# EAGLE design Grip-Mother (EAGLE 9.6.2)
COMPANY: ADAFRUIT INDUSTRIES; DRAWN: KTOWN; REV: B
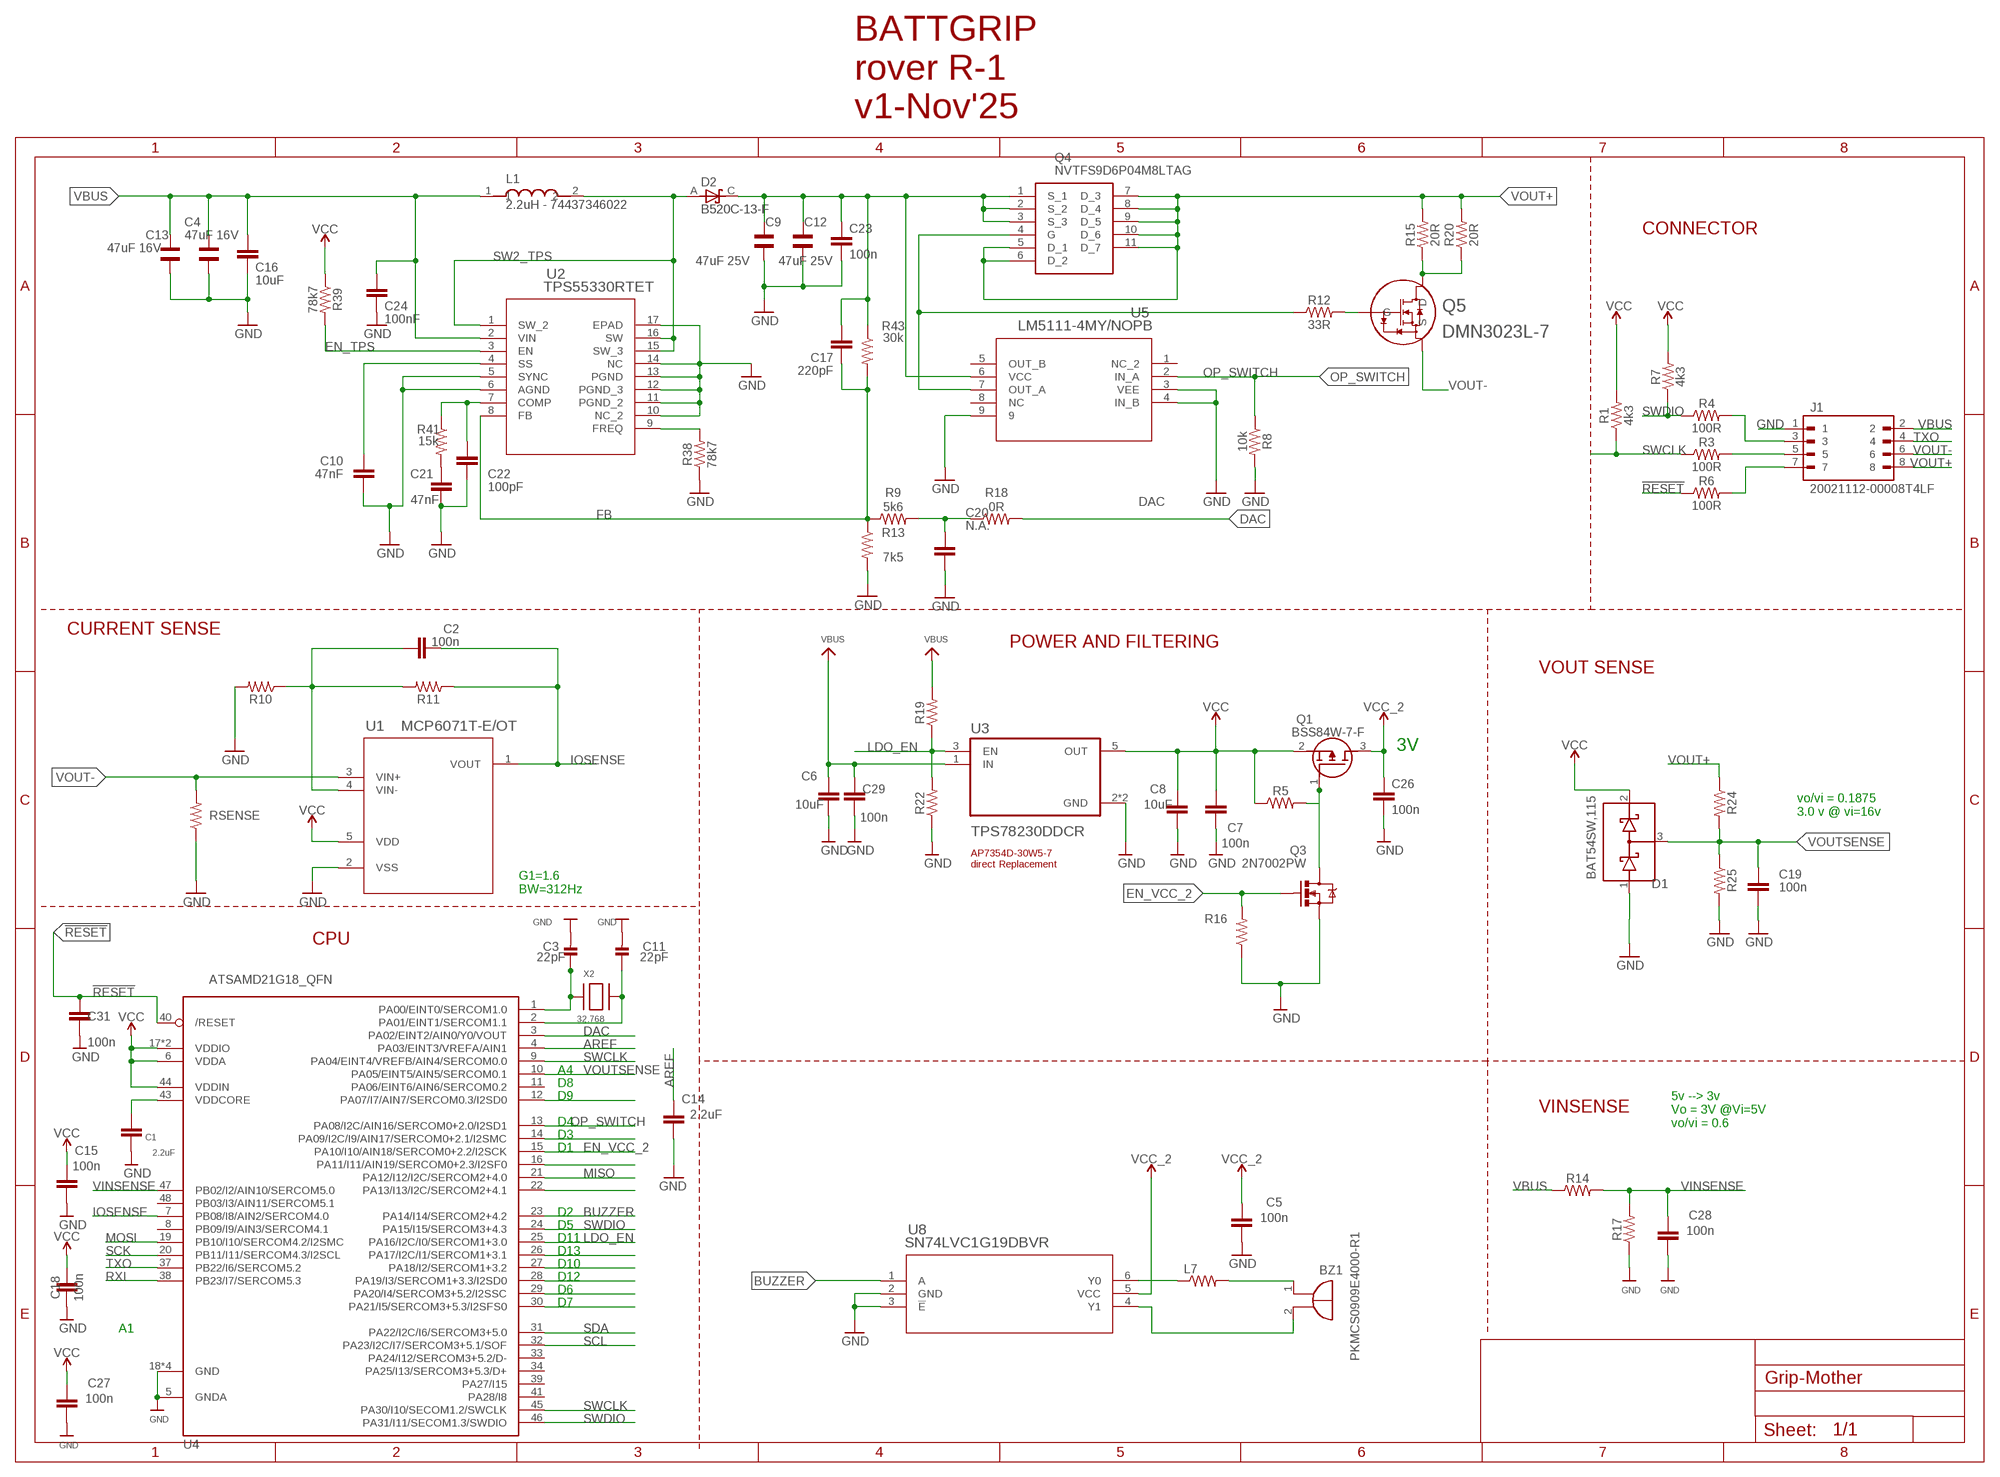
[diagram p0: schematic, sheet 1]

## Parts
BZ1  PKMCS0909E4000-R1  [PKMCS0909]
C1  2.2uF  2.2UF-0603-10V-20%  [0603]
C2  100n  0.1UF-0603-25V-(+80/-20%)  [0603]
C3  22pF  CAP_CERAMIC0603_NO  [0603-NO]
C4  47uF 16V  WCAP-CSGP_1210_885012109003  [WCAP-CSGP_1210]
C5  100n  0.1UF-0402-16V-10%  [0402]
C6  10uF  2.2UF-0603-10V-20%  [0603]
C7  100n  0.1UF-0402-16V-10%  [0402]
C8  10uF  2.2UF-0603-10V-20%  [0603]
C9  47uF 25V  WCAP-CSGP_1210_885012109003  [WCAP-CSGP_1210]
C10  47nF  47NF-0603-25V-5%  [0603]
C11  22pF  CAP_CERAMIC0603_NO  [0603-NO]
C12  47uF 25V  WCAP-CSGP_1210_885012109003  [WCAP-CSGP_1210]
C13  47uF 16V  WCAP-CSGP_1210_885012109003  [WCAP-CSGP_1210]
C14  2.2uF  2.2UF-0603-10V-20%  [0603]
C15  100n  0.1UF-0402-16V-10%  [0402]
C16  10uF  10UF-0805-10V-10%  [0805]
C17  220pF  270PF-0603-50V-5%  [0603]
C18  100n  0.1UF-0402-16V-10%  [0402]
C19  100n  0.1UF-0603-25V-(+80/-20%)  [0603]
C20  N.A.  0.1UF-0603-25V-(+80/-20%)  [0603]
C21  47nF  2.2NF/2200PF-0603-50V-10%  [0603]
C22  100pF  270PF-0603-50V-5%  [0603]
C23  100n  0.1UF-0603-25V-(+80/-20%)  [0603]
C24  100nF  0.1UF-0603-25V-(+80/-20%)  [0603]
C26  100n  0.1UF-0402-16V-10%  [0402]
C27  100n  0.1UF-0402-16V-10%  [0402]
C28  100n  0.1UF-0402-16V-10%  [0402]
C29  100n  0.1UF-0402-16V-10%  [0402]
C31  100n  0.1UF-0402-16V-10%  [0402]
D1  BAT54SW,115  [SOT65P210X110-3N]
D2  B520C-13-F  [DIOM7959X250N]
J1  20021112-00008T4LF  [AMPHENOL_20021112-00008T4LF]
L1  2.2uH - 74437346022  74437349100  [INDM7366X500]
L7  MMZ2012Y202BT000  RESISTOR0805-RES  [0805]
Q1  BSS84W-7-F  [SOT65P222X110-3N]
Q3  2N7002PW  MOSFET-NCHANNEL2N7002PW  [SOT323]
Q4  NVTFS9D6P04M8LTAG  [NVTFS5124PLTWG]
Q5  DMN3023L-7  PMV20XNERSOT23-TO-236AB_NEX-L  [SOT23-TO-236AB_NEX-L]
R1  4k3  RESISTOR0402  [0402]
R3  100R  RESISTOR0402  [0402]
R4  100R  RESISTOR0402  [0402]
R5  RESISTOR0402  [0402]
R6  100R  RESISTOR0402  [0402]
R7  4k3  RESISTOR0402  [0402]
R8  10k  RESISTOR0402  [0402]
R9  5k6  RESISTOR0402  [0402]
R10  RESISTOR0402  [0402]
R11  RESISTOR0402  [0402]
R12  33R  RESISTOR0402  [0402]
R13  7k5  RESISTOR0402  [0402]
R14  RESISTOR0402  [0402]
R15  20R  RESISTOR1206  [1206]
R16  RESISTOR0402  [0402]
R17  RESISTOR0402  [0402]
R18  0R  RESISTOR0402  [0402]
R19  RESISTOR0402  [0402]
R20  20R  RESISTOR1206  [1206]
R22  RESISTOR0402  [0402]
R24  RESISTOR0402  [0402]
R25  RESISTOR0402  [0402]
R38  78k7  RESISTOR0402  [0402]
R39  78k7  RESISTOR0402  [0402]
R41  15k  RESISTOR0402  [0402]
R43  30k  RESISTOR0402  [0402]
RSENSE  RESISTOR1206  [1206]
U1  MCP6071T-E/OT  [SOT-23-5_MC_MCH]
U2  TPS55330RTET  [RTE16_1P66X1P66_TEX]
U3  TPS78230DDCR  [SOT95P280X110-5N]
U4  ATSAMD21G18_QFN  ATSAMD21J_QFN  [TQFN48_7MM]
U5  LM5111-4MY/NOPB  [MUY08A]
U8  SN74LVC1G19DBVR  [DBV6]
X2  32.768  XTAL-3.2X1.5  [XTAL3215]

## Nets
!RESET: C31.1 R6.1 U4.40(/RESET)
AREF: C14.1 U4.4(PA03/EINT3/VREFA/AIN1)
BUZZER: U4.23(PA14/I14/SERCOM2+4.2) U8.1(A)
COMP_TPS: C22.2 R41.1 U2.7(COMP)
DAC: R18.2 U4.3(PA02/EINT2/AIN0/Y0/VOUT)
EN_TPS: R39.2 U2.3(EN)
EN_VCC_2: Q3.1(G) R16.2 U4.15(PA10/I10/AIN18/SERCOM0+2.2/I2SCK)
FB: C17.1 R9.1 R13.1 R43.2 U2.8(FB)
FREQ_TPS: R38.2 U2.9(FREQ)
GND: C1.2 C3.2 C4.1 C5.2 C6.2 C7.2 C8.2 C9.1 C10.2 C11.2 C12.1 C13.1 C14.2 C15.2 C16.1 C18.2 C19.2 C20.2 C21.1 C22.1 C23.2 C24.1 C26.2 C27.2 C28.2 C29.2 C31.2 D1.1(A) J1.1 Q3.2(S) R8.2 R10.2 R13.2 R16.1 R17.1 R22.1 R25.2 R38.1 RSENSE.1 U1.2(VSS) U2.5(SYNC) U2.6(AGND) U2.10(NC_2) U2.11(PGND_2) U2.12(PGND_3) U2.13(PGND) U2.14(NC) U2.17(EPAD) U3.2(GND) U3.4(GND) U4.5(GNDA) U4.18(GND) U4.35(GND) U4.42(GND) U4.THERMAL(GND) U5.3(VEE) U5.4(IN_B) U5.9 U8.2(GND) U8.3(!E)
IOSENSE: C2.1 R11.1 U1.1(VOUT) U4.7(PB08/I8/AIN2/SERCOM4.0)
LDO_EN: R19.1 R22.2 U3.3(EN) U4.25(PA16/I2C/I0/SERCOM1+3.0)
MISO: U4.21(PA12/I12/I2C/SERCOM2+4.0)
MOSI: U4.19(PB10/I10/SERCOM4.2/I2SMC)
N$1: Q4.4(G) R12.1 U5.7(OUT_A)
N$2: J1.7 R6.2
N$3: J1.5 R3.2
N$5: C2.2 R10.1 R11.2 U1.4(VIN-)
N$6: Q1.1(G) Q3.3(D) R5.2
N$7: U4.14(PA09/I2C/I9/AIN17/SERCOM0+2.1/I2SMC)
N$8: Q5.3(D) R15.1 R20.1
N$9: C3.1 U4.1(PA00/EINT0/SERCOM1.0) X2.P$1
N$10: C11.1 U4.2(PA01/EINT1/SERCOM1.1) X2.P$2
N$11: J1.3 R4.2
N$12: C20.1 R9.2 R18.1
N$13: Q5.1(G) R12.2
N$14: U4.16(PA11/I11/AIN19/SERCOM0+2.3/I2SF0)
N$15: U4.22(PA13/I13/I2C/SERCOM2+4.1)
N$17: L7.1 U8.6(Y0)
N$18: U4.26(PA17/I2C/I1/SERCOM1+3.1)
N$19: BZ1.1(+) L7.2
N$20: U4.27(PA18/I2/SERCOM1+3.2)
N$21: U4.28(PA19/I3/SERCOM1+3.3/I2SD0)
N$22: BZ1.2(-) U8.4(Y1)
N$23: U4.29(PA20/I4/SERCOM3+5.2/I2SSC)
N$24: U4.30(PA21/I5/SERCOM3+5.3/I2SFS0)
N$25: U4.12(PA07/I7/AIN7/SERCOM0.3/I2SD0)
N$35: C10.1 U2.4(SS)
N$43: C21.2 R41.2
OP_SWITCH: R8.1 U4.13(PA08/I2C/AIN16/SERCOM0+2.0/I2SD1) U5.2(IN_A)
RXI: U4.38(PB23/I7/SERCOM5.3)
SCK: U4.20(PB11/I11/SERCOM4.3/I2SCL)
SCL: U4.32(PA23/I2C/I7/SERCOM3+5.1/SOF)
SDA: U4.31(PA22/I2C/I6/SERCOM3+5.0)
SW2_TPS: D2.A L1.2 U2.1(SW_2) U2.15(SW_3) U2.16(SW)
SWCLK: R1.1 R3.1 U4.9(PA04/EINT4/VREFB/AIN4/SERCOM0.0) U4.45(PA30/I10/SECOM1.2/SWCLK)
SWDIO: R4.1 R7.1 U4.24(PA15/I15/SERCOM3+4.3) U4.46(PA31/I11/SECOM1.3/SWDIO)
TXO: J1.4 U4.37(PB22/I6/SERCOM5.2)
VBUS: C4.2 C6.1 C13.2 C16.2 C24.2 C29.1 J1.2 L1.1 R14.1 R19.2 U2.2(VIN) U3.1(IN)
VCC: C7.1 C8.1 C15.1 C18.1 C27.1 D1.2(C) Q1.2(S) R1.2 R5.1 R7.2 R39.1 U1.5(VDD) U3.5(OUT) U4.6(VDDA) U4.17(VDDIO) U4.36(VDDIO) U4.44(VDDIN)
VCC_2: C5.1 C26.1 Q1.3(D) U8.5(VCC)
VDDCORE1: C1.1 U4.43(VDDCORE)
VINSENSE: C28.1 R14.2 R17.2 U4.47(PB02/I2/AIN10/SERCOM5.0)
VOUT+: J1.8 Q4.5(D_1) Q4.6(D_2) Q4.7(D_3) Q4.8(D_4) Q4.9(D_5) Q4.10(D_6) Q4.11(D_7) R15.2 R20.2 R24.1
VOUT-: J1.6 Q5.2(S) RSENSE.2 U1.3(VIN+)
VOUTSENSE: C19.1 D1.3(A-C) R24.2 R25.1 U4.10(PA05/EINT5/AIN5/SERCOM0.1)
VSOURCE: C9.2 C12.2 C17.2 C23.1 D2.C Q4.1(S_1) Q4.2(S_2) Q4.3(S_3) R43.1 U5.6(VCC)
Unconnected: U4.8(PB09/I9/AIN3/SERCOM4.1) U4.11(PA06/EINT6/AIN6/SERCOM0.2) U4.33(PA24/I12/SERCOM3+5.2/D-) U4.34(PA25/I13/SERCOM3+5.3/D+) U4.39(PA27/I15) U4.41(PA28/I8) U4.48(PB03/I3/AIN11/SERCOM5.1) U5.1(NC_2) U5.5(OUT_B) U5.8(NC)

## Notes on the sheet
- BATTGRIP
  rover R-1
  v1-Nov'25
- CONNECTOR
- CURRENT SENSE
- POWER AND FILTERING
- VOUT SENSE
- 3V
- vo/vi = 0.1875
  3.0 v @ vi=16v
- AP7354D-30W5-7 
  direct Replacement
- G1=1.6
  BW=312Hz
- CPU
- A4
- D8
- D9
- VINSENSE
- D4
- D3
- D1
- 5v --> 3v
  Vo = 3V @Vi=5V
  vo/vi = 0.6
- D2
- D5
- D11
- D13
- D10
- D12
- D6
- D7
- A1

## Library data of the parts
BZ1 = buzzer:PKMCS0909E4000-R1: PKMCS0909E4000-R1 Source : http://www.murata.com/~/media/webrenewal/products/sound/sounder/vppt-buzj083-d.ashx
C1 C14 = SparkFun-Capacitors:2.2UF: 2.2µF ceramic capacitors A capacitor is a passive two-terminal electrical component used to store electrical energy temporarily in an electric field.; PROD_ID: CAP-07888
C2 C19 C20 C23 C24 = SparkFun-Capacitors:0.1UF: 0.1µF ceramic capacitors A capacitor is a passive two-terminal electrical component used to store electrical energy temporarily in an electric field.; PROD_ID: CAP-00810; VALUE: 0.1uF
C3 C11 = microbuilder:CAP_CERAMIC: Ceramic Capacitors For new designs, use the packages preceded by an '_' character since they are more reliable: The following footprints should be used on most boards: _0402 - Standard footprint for regular board layouts _0603 - Standard footprint for regular board layouts _0805 - Standard footprint for regular board layouts _1206 - Standard footprint for regular board layouts For extremely tight-pitch boards where space is at a premium, the following 'micro-pitch' footprints can be used (smaller pads, no silkscreen outline, etc.): _0402MP - Micro-pitch footprint for very dense/compact boards _0603MP - Micro-pitch footprint for very dense/compact boards _0805MP - Micro-pitch footprint for very dense/compact boards _1206MP - Micro-pitch footprint for very dense/compact boards
C4 C9 C12 C13 = Wurth_Elektronik_Passive_Capacitors_rev19a:WCAP-CSGP_1210: WCAP-CSGP Ceramic Capacitors Characteristics Multilayer Ceramic Chip Capacitor Recommended soldering:Reflow, for 0603 and 0805 wave soldering is also allowed Operating temperature:-55 °C to +125 °C; Ceramic characteristics: Class I - NPO ; Class II -X7R, X5R High performance ceramic High capacitance stability Minimal aging Termination:Cu/Ni/Sn <http://katalog.we-online.de/media/images/eisos/WCAP-CSGP_pf2.jpg> Details see: http://katalog.we-online.de/en/pbs/WCAP-CSGP-1210? Created: 2015-01-28 2015 (C) Wurth Elektronik; WE-NUMBER: 885012109003/47uF
C5 C7 C15 C18 C26-C29 C31 = SparkFun-Capacitors:0.1UF: 0.1µF ceramic capacitors A capacitor is a passive two-terminal electrical component used to store electrical energy temporarily in an electric field.; PROD_ID: CAP-12416; VALUE: 0.1uF
C6 C8 = SparkFun-Capacitors:2.2UF: 2.2µF ceramic capacitors A capacitor is a passive two-terminal electrical component used to store electrical energy temporarily in an electric field.; PROD_ID: CAP-07888; VALUE: 2.2uF
C10 = SparkFun-Capacitors:47NF: 47nF ceramic capacitors A capacitor is a passive two-terminal electrical component used to store electrical energy temporarily in an electric field.; PROD_ID: CAP-08605
C16 = SparkFun-Capacitors:10UF: 10.0µF ceramic capacitors A capacitor is a passive two-terminal electrical component used to store electrical energy temporarily in an electric field.; PROD_ID: CAP-11330
C17 C22 = SparkFun-Capacitors:270PF: 270pF/0.27nF ceramic capacitors A capacitor is a passive two-terminal electrical component used to store electrical energy temporarily in an electric field.; PROD_ID: CAP-13339; VALUE: 270PF
C21 = SparkFun-Capacitors:2.2NF/2200PF: 2.2nF/2,200pF ceramic capacitors A capacitor is a passive two-terminal electrical component used to store electrical energy temporarily in an electric field.; PROD_ID: CAP-07877; VALUE: 2.2nF
D1 = BAT54SW_115:BAT54SW,115: BAT54W Series 30 V 600 mA SMT Schottky Barrier Double Diode -SOT-323 Check availability <https://pricing.snapeda.com/parts/BAT54SW%2C115/Nexperia%20USA%20Inc./view-part?ref=eda>; AVAILABILITY: In Stock; DESCRIPTION: Diode Array 1 Pair Series Connection Schottky 30 V 200mA (DC) Surface Mount SC-70, SOT-323; MF: Nexperia USA Inc.; MP: BAT54SW,115; PACKAGE: SOT-323 Nexperia USA Inc.; PRICE: None; PURCHASE-URL: https://pricing.snapeda.com/search/part/BAT54SW,115/?ref=eda
D2 = B520C-13-F:B520C-13-F: 5.0A SURFACE MOUNT SCHOTTKY BARRIER RECTIFIER; AVAILABILITY: Unavailable; DESCRIPTION: Diode Schottky 20V 5A Surface Mount SMC; DIGIKEY-PURCHASE-URL: https://snapeda.com/shop?store=DigiKey&id=325969; MF: Diodes Inc.; MP: B520C-13-F; PACKAGE: DO-214 Diodes Inc.; PRICE: None
J1 = 20021112-00008T4LF:20021112-00008T4LF; CHECK_PRICES: https://www.snapeda.com/parts/20021112-00008T4LF/Amphenol/view-part/?ref=eda; DESCRIPTION: Minitek127, Board to Board connector, Unshrouded Right Angled Header, Through Hole, Double Row, 8 Positions, 1.27 mm (.050in) Pitch.; DIGIKEY_PART_NUMBER: 609-5925-ND; MF: AMPHENOL ICC / FCI; MP: 20021112-00008T4LF; PACKAGE: None; SNAPEDA_LINK: https://www.snapeda.com/parts/20021112-00008T4LF/Amphenol/view-part/?ref=snap
L1 = Inductance_2.2uH:74437349100: Inductor, SMD [Würth Elektronik] 74437349100 Inductor, SMD; DESCRIPTION: 10µH Shielded Molded Inductor 3.2A 69mOhm Max Nonstandard; DIGIKEY-PURCHASE-URL: https://snapeda.com/shop?store=DigiKey&id=586788; MF: Wurth Electronics; MP: 74437349100; PACKAGE: Nonstandard Wurth Electronics
L7 = SparkFun:RESISTOR: Resistor Basic schematic elements and footprints for 0603, 1206, and PTH resistors.
Q1 = BSS84W-7-F:BSS84W-7-F: Lattice Source: Datasheet <https://www.diodes.com/assets/Datasheets/BSS84W.pdf>; DESCRIPTION: Lattice; HEIGHT: 1.1mm; MANUFACTURER_NAME: Lattice Semiconductor; MANUFACTURER_PART_NUMBER: BSS84W-7-F; MOUSER_PART_NUMBER: N/A; MOUSER_PRICE-STOCK: https://www.mouser.com/Search/Refine.aspx?Keyword=N%2FA
Q3 = SparkFun-DiscreteSemi:MOSFET-NCHANNEL: Common NMOSFET Parts MFG P/N Store ID Prod ID FDD8780 TRANS-09984 SI7820DN TRANS-11055 FDS6630A IC-08089 2N7002PW TRANS-11151 FQP30N06L COM-10213 TRANS-10060 BSS123LT1G TRANS-08345 BSS138 TRANS-00830 BS170 2N7000; PROD_ID: TRANS-11151
Q4 = SamacSys_Parts:NVTFS9D6P04M8LTAG: MOSFET MV8 P INITIAL PROGRAM Source: Datasheet <https://www.onsemi.com/pub/Collateral/NVTFS9D6P04M8L-D.PDF>; DESCRIPTION: MOSFET MV8 P INITIAL PROGRAM; HEIGHT: 0.8mm; MANUFACTURER_NAME: ON Semiconductor; MANUFACTURER_PART_NUMBER: NVTFS9D6P04M8LTAG; MOUSER_PART_NUMBER: 863-NVTFS9D6P04M8LTG; MOUSER_PRICE-STOCK: https://www.mouser.co.uk/ProductDetail/ON-Semiconductor/NVTFS9D6P04M8LTAG/?qs=xZ%2FP%252Ba9zWqYALd8g5rll2Q%3D%3D
Q5 = PMV20XNER:PMV20XNER; COPYRIGHT: Copyright (C) 2023 Ultra Librarian. All rights reserved.; MANUFACTURER_PART_NUMBER: PMV20XNER; MFR_NAME: Nexperia
R1 R3-R20 R22 R24 R25 R38 R39 R41 R43 RSENSE = SparkFun-Resistors:RESISTOR: Generic Resistor Package
U1 = MCP6071:MCP6071T-E/OT; BUILT_BY: EMA_Jessica; COPYRIGHT: Copyright (C) 2018 Accelerated Designs. All rights reserved; MANUFACTURER_PART_NUMBER: MCP6071T-E/OT; SOURCELIBRARY: Microchip_2019-08-23_21; VENDOR: Microchip
U2 = TPS55330:TPS55330RTET; BUILT_BY: EMA_UL_Team; MANUFACTURER_PART_NUMBER: TPS55330RTET; SOURCELIBRARY: TI_2015-1-5; VENDOR: Texas Instruments
U3 = TPS78230DDCR:TPS78230DDCR: Check prices <https://pricing.snapeda.com/parts/TPS78230DDCR/Texas%20Instruments/view-part?ref=eda>; AVAILABILITY: Good; DESCRIPTION: 150-mA, nano-IQ, low-dropout voltage regulator with enable from -40C to +125C 5-SOT-23-THIN -40 to 125; MF: Texas Instruments; MP: TPS78230DDCR; PACKAGE: SOT-23-THN-5 Texas Instruments; PRICE: None; PURCHASE-URL: https://pricing.snapeda.com/search/part/TPS78230DDCR/?ref=eda
U4 = microbuilder:ATSAMD21J
U5 = LM5111-4MY:LM5111-4MY/NOPB; COPYRIGHT: Copyright (C) 2024 Ultra Librarian. All rights reserved.; MANUFACTURER_PART_NUMBER: LM5111-4MY/NOPB; MFR_NAME: Texas Instruments; TYPE: LM5111-1MY
U8 = SN74LVC1G19DBVR:SN74LVC1G19DBVR; DATASHEET_URL: http://www.ti.com/lit/gpn/SN74LVC1G19; DESCRIPTION: 1-of-2 Decoder/Demultiplexer; FAMILY_NAME: LL Decoder, Mux/Demux; GENERIC_PART_NUMBER: SN74LVC1G19; INDUSTRY_STD_PKG_TYPE: SOT-23; MANUFACTURER: Texas Instruments; MANUFACTURER_PART_NUMBER: SN74LVC1G19DBVR; PACKAGE_DESIGNATOR: DBV; PIN_COUNT: 6; VENDOR: Texas Instruments
X2 = adafruit2:XTAL: Low cost SMT crystals, no capacitors included http://www.ladyada.net/library/eagle

## Net classes
2 gnd: width 0.305 mm, drill 0.483 mm, clearance 0.203 mm

## Board
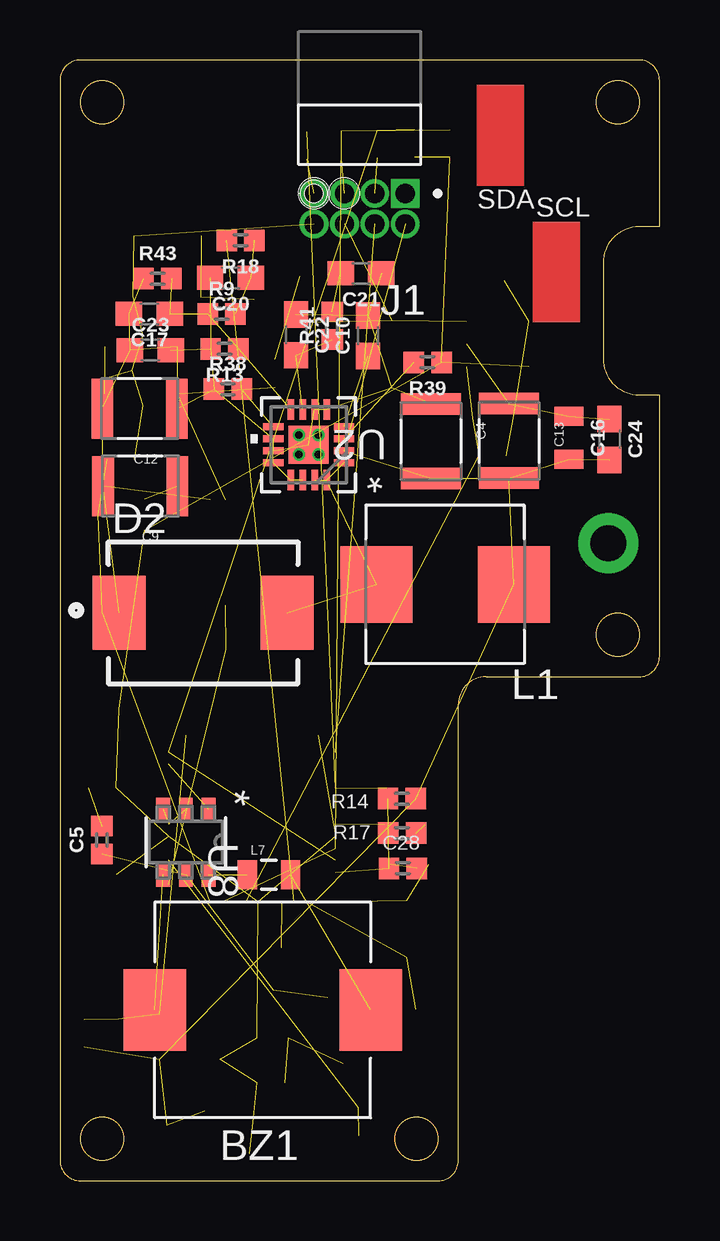
[diagram p1: board, top side]
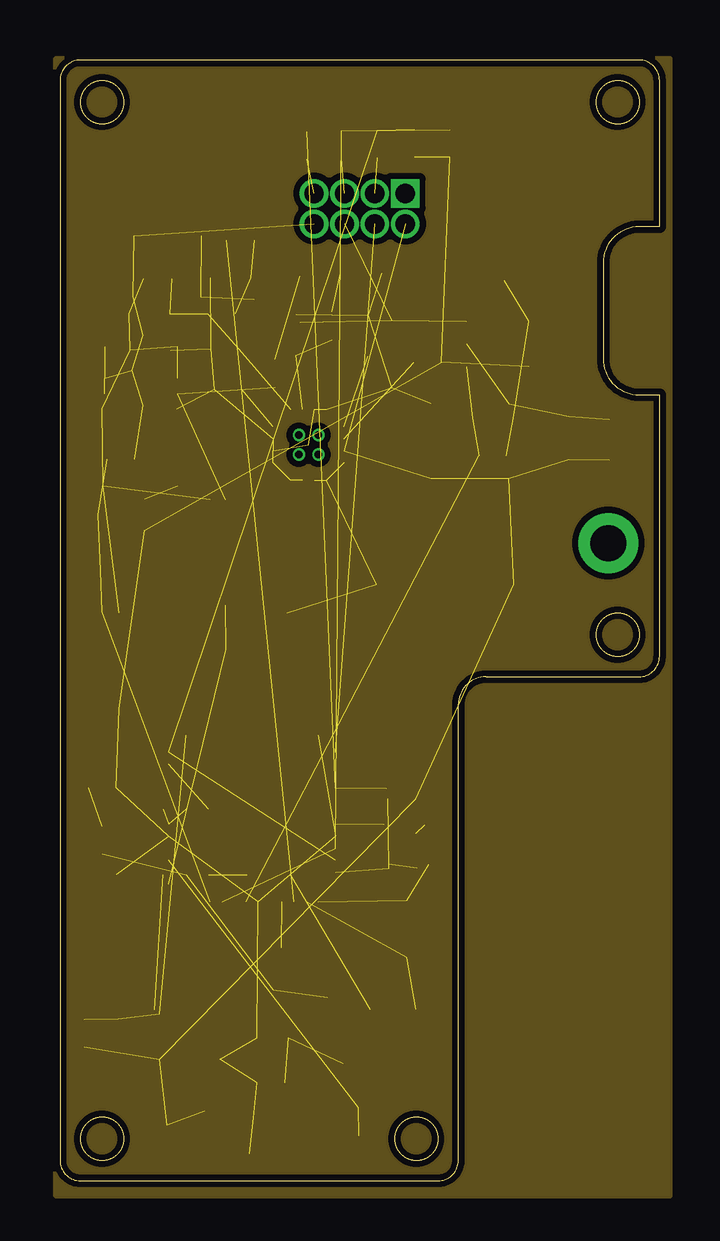
[diagram p2: board, inner layer Route2]
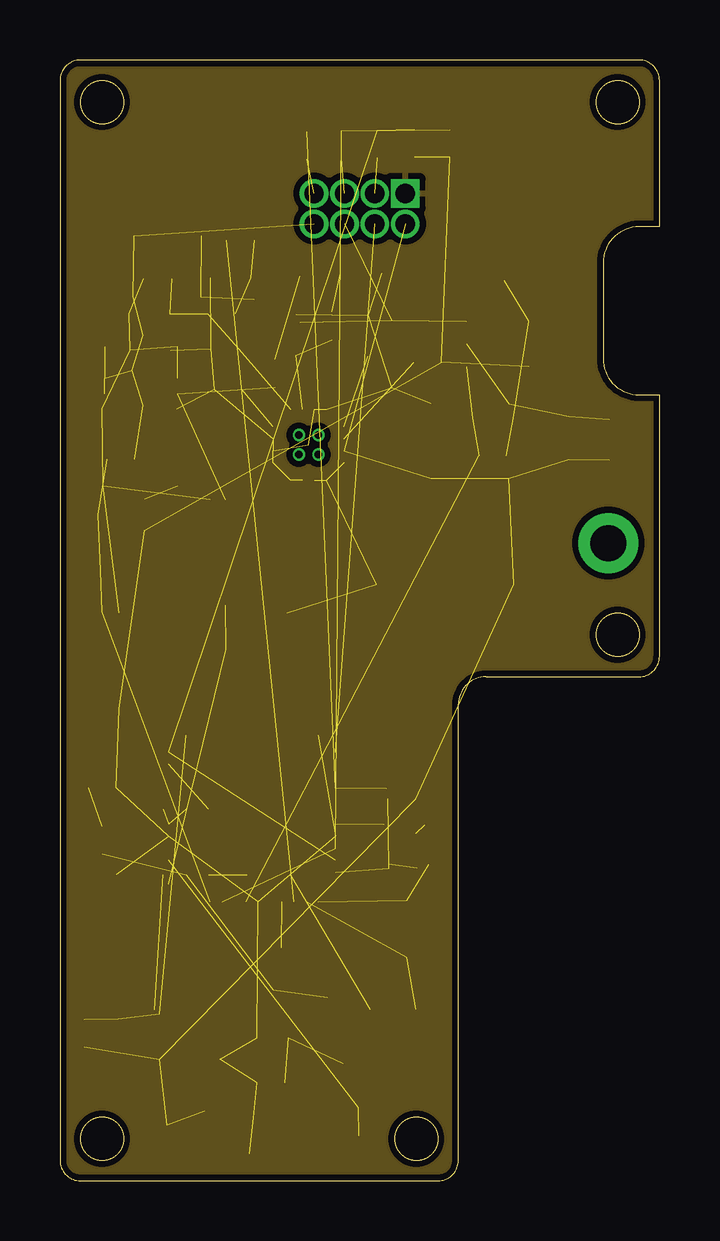
[diagram p3: board, inner layer GND]
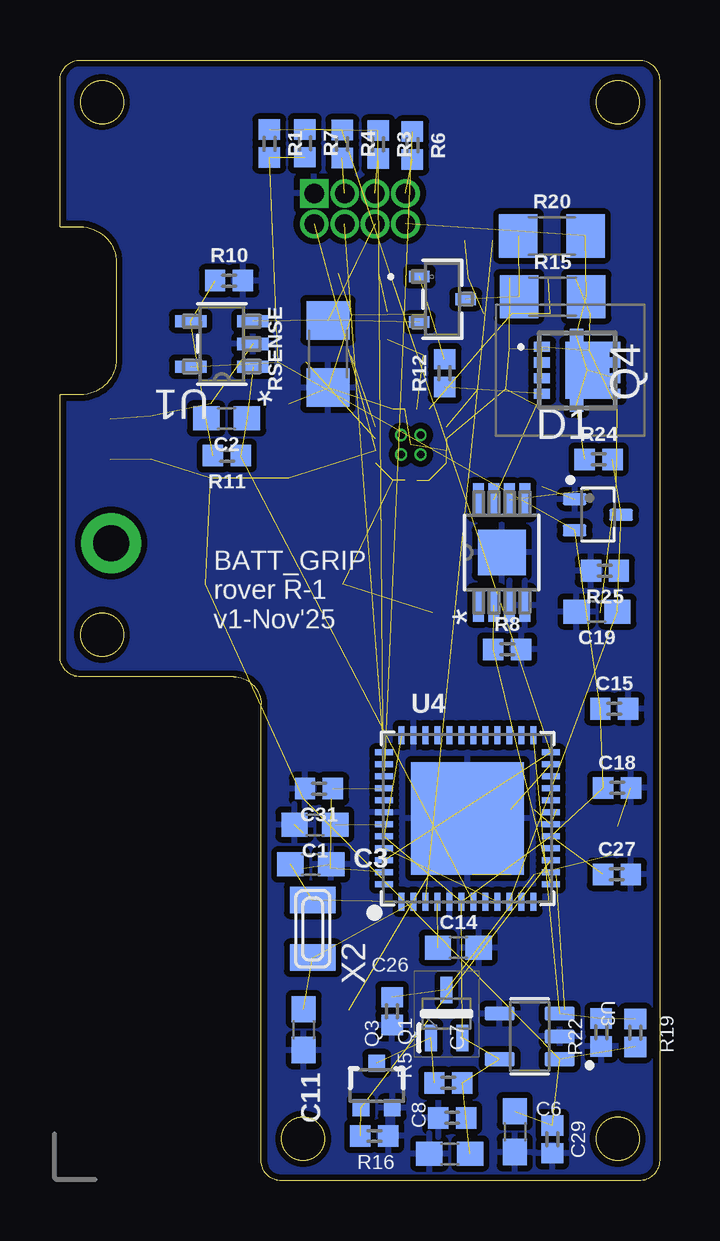
[diagram p4: board, bottom side, seen from below]

Size 25 x 46.7 mm. Coordinates in mm from the lower left corner, seen from the top.
Outline: 22.65,34.25 arc90 24.15,32.75 25,32.75 25,21.85 arc-90 24.15,21 17.76,21 arc90 16.61,19.85 16.61,0.85 arc-90 15.76,0 0.85,0 arc-90 0,0.85 0,45.85 arc-90 0.85,46.7 24.15,46.7 arc-90 25,45.85 25,39.75 24.15,39.75 arc90 22.65,38.25 22.65,34.25
Outline: circle at 1.75,1.75 radius 0.9
Outline: circle at 23.25,44.95 radius 0.9
Outline: circle at 23.25,22.75 radius 0.9
Outline: circle at 1.75,44.95 radius 0.9
Outline: circle at 14.86,1.75 radius 0.9
Copper layers (1+2*15+16): Top 0.035mm / dielectric 1.5mm / Route2 0.035mm / dielectric 0.15mm / GND 0.035mm / dielectric 0.2mm / Bottom 0.035mm
Design rules "adafruit *": minimum track width 4mil, minimum drill 0.25mm, track to track 8mil, track to pad 8mil, pad to pad 8mil, via to via 8mil, smd to smd 5mil, copper to edge 10mil, drill to drill 8mil, minimum pad ring 2mil, minimum via ring 2mil, stop-mask expansion 2mil, vias tented up to drill 20mil, thermal gap 10mil

### Footprints (pad centres in the part's own frame; a part is rotated, then mirrored left to right if it is on the bottom)
PKMCS0909 = smd 2.6 x 3.4: 1 -4.5,0; 2 4.5,0
0603 = smd 1.1 x 1: 1 -0.85,0; 2 0.85,0
0603-NO = smd 1.1 x 1: 1 -0.85,0; 2 0.85,0
WCAP-CSGP_1210 = smd 0.9 x 2.5: 1 -1.55,0; 2 1.55,0
0402 = smd 0.85 x 0.9: 1 -0.58,0; 2 0.58,0
0805 = smd 0.8 x 1.2: 1 -0.9,0; 2 0.9,0
SOT65P210X110-3N = smd 0.99 x 0.5: 1 -0.97,0.65; 2 -0.97,-0.65; 3 0.97,0
DIOM7959X250N = smd 2.2 x 3.1: A 3.5,0; C -3.5,0
AMPHENOL_20021112-00008T4LF = drill 0.8 pad 1.1 square: 1 -1.905,2.45 | drill 0.8 pad 1.1: 2 -1.905,3.72; 3 -0.635,2.45; 4 -0.635,3.72; 5 0.635,2.45; 6 0.635,3.72; 7 1.905,2.45; 8 1.905,3.72
INDM7366X500 = smd 3 x 3.2: 1 -2.87,0; 2 2.87,0
SOT65P222X110-3N = smd 1.1 x 0.5: 1 -1,0.65; 2 -1,-0.65; 3 1,0
SOT323 = smd 0.7 x 0.7: 1 -0.65,-0.925; 2 0.65,-0.925; 3 0,0.925
NVTFS5124PLTWG = smd 0.42 x 0.66: 1 -0.975,-1.47; 2 -0.325,-1.47; 3 0.325,-1.47; 4 0.975,-1.47 | smd 0.42 x 0.47: 5 0.975,1.565; 6 0.325,1.565; 7 -0.325,1.565; 8 -0.975,1.565 | smd 2.37 x 1.83: 9 0,0.415 | smd 0.545 x 0.57: 10 1.458,-0.035; 11 -1.458,-0.035
SOT23-TO-236AB_NEX-L = smd 0.483 x 0.864: 1 -0.95,-0.965; 2 0.95,-0.965; 3 0,0.965
1206 = smd 1.6 x 1.8: 1 -1.4,0; 2 1.4,0
SOT-23-5_MC_MCH = smd 1.31 x 0.508: 1 -1.295,0.95; 2 -1.295,0; 3 -1.295,-0.95; 4 1.295,-0.95; 5 1.295,0.95
RTE16_1P66X1P66_TEX = smd 0.85 x 0.28: 1 -1.475,0.75; 2 -1.475,0.25; 3 -1.475,-0.25; 4 -1.475,-0.75; 9 1.475,-0.75; 10 1.475,-0.25; 11 1.475,0.25; 12 1.475,0.75 | smd 0.28 x 0.85: 5 -0.75,-1.475; 6 -0.25,-1.475; 7 0.25,-1.475; 8 0.75,-1.475; 13 0.75,1.475; 14 0.25,1.475; 15 -0.25,1.475; 16 -0.75,1.475 | smd 1.66 x 1.6: 17 0,0 | drill 0.305 pad 0.508: V -0.406,-0.406; V_1 -0.406,0.406; V_2 0.406,-0.406; V_3 0.406,0.406
SOT95P280X110-5N = smd 1.25 x 0.59: 1 -1.255,0.95; 2 -1.255,0; 3 -1.255,-0.95; 4 1.255,-0.95; 5 1.255,0.95
TQFN48_7MM = smd 0.25 x 0.75: 1 -2.75,-3.475; 2 -2.25,-3.475; 3 -1.75,-3.475; 4 -1.25,-3.475; 5 -0.75,-3.475; 6 -0.25,-3.475; 7 0.25,-3.475; 8 0.75,-3.475; 9 1.25,-3.475; 10 1.75,-3.475; 11 2.25,-3.475; 12 2.75,-3.475; 25 2.75,3.475; 26 2.25,3.475; 27 1.75,3.475; 28 1.25,3.475; 29 0.75,3.475; 30 0.25,3.475; 31 -0.25,3.475; 32 -0.75,3.475; 33 -1.25,3.475; 34 -1.75,3.475; 35 -2.25,3.475; 36 -2.75,3.475 | smd 0.75 x 0.25: 13 3.475,-2.75; 14 3.475,-2.25; 15 3.475,-1.75; 16 3.475,-1.25; 17 3.475,-0.75; 18 3.475,-0.25; 19 3.475,0.25; 20 3.475,0.75; 21 3.475,1.25; 22 3.475,1.75; 23 3.475,2.25; 24 3.475,2.75; 37 -3.475,2.75; 38 -3.475,2.25; 39 -3.475,1.75; 40 -3.475,1.25; 41 -3.475,0.75; 42 -3.475,0.25; 43 -3.475,-0.25; 44 -3.475,-0.75; 45 -3.475,-1.25; 46 -3.475,-1.75; 47 -3.475,-2.25; 48 -3.475,-2.75 | smd 4.7 x 4.7: THERMAL 0,0
MUY08A = smd 1.372 x 0.457: 1 -2.197,0.975; 2 -2.197,0.325; 3 -2.197,-0.325; 4 -2.197,-0.975; 5 2.197,-0.975; 6 2.197,-0.325; 7 2.197,0.325; 8 2.197,0.975 | smd 1.88 x 2.007: 9 0,0
DBV6 = smd 0.972 x 0.568: 1 -1.362,0.95; 2 -1.362,0; 3 -1.362,-0.95; 4 1.362,-0.95; 5 1.362,0; 6 1.362,0.95
XTAL3215 = smd 1.1 x 1.9: P$1 1.2,0; P$2 -1.2,0

### Placement (x,y rotation side)
BZ1  8.45,7.12 180 top
C1  14.37,14.84 180 bottom
C2  18.05,31.77 180 bottom
C3  14.54,13.18 0 bottom
C4  15.46,30.82 270 top
C5  1.75,14.2 90 top
C6  6.03,2.05 270 bottom
C7  8.65,2.62 180 bottom
C8  8.75,1.13 180 bottom
C9  3.35,28.94 180 top
C10  12.85,35.21 90 top
C11  14.84,6.3 270 bottom
C12  3.32,32.17 180 top
C13  18.72,30.83 270 top
C14  8.39,9.72 0 bottom
C15  1.89,19.67 0 bottom
C16  21.22,30.96 270 top
C17  3.73,36.13 180 top
C18  1.77,16.37 0 bottom
C19  2.61,23.72 180 bottom
C20  7.11,37.62 180 top
C21  12.55,37.81 180 top
C22  9.85,35.25 270 top
C23  3.77,34.61 0 top
C24  22.91,30.89 270 top
C26  11.15,7.07 270 bottom
C27  1.78,12.77 0 bottom
C28  14.3,13.02 0 top
C29  4.47,1.73 270 bottom
C31  14.2,16.34 180 bottom
D1  2.57,27.75 0 bottom
D2  5.97,23.67 0 top
J1  12.49,43.59 180 top
L1  16.06,24.85 180 top
L7  8.71,12.75 0 top
Q1  8.88,6.96 90 bottom
Q3  11.79,3.97 0 bottom
Q4  3.43,33.77 270 bottom
Q5  9.05,36.73 270 bottom
R1  16.27,43.22 270 bottom
R3  11.73,43.18 270 bottom
R4  13.23,43.2 270 bottom
R5  8.8,4.08 180 bottom
R6  10.31,43.14 270 bottom
R7  14.79,43.23 270 bottom
R8  6.35,22.14 0 bottom
R9  6.74,36.12 0 top
R10  17.95,37.51 0 bottom
R11  18.04,30.22 180 bottom
R12  8.96,33.65 90 bottom
R13  6.86,34.66 180 top
R14  14.26,15.93 180 top
R15  4.46,36.84 0 bottom
R16  11.89,1.87 180 bottom
R17  14.27,14.49 180 top
R18  7.53,39.18 180 top
R19  1.01,6.16 270 bottom
R20  4.49,39.37 0 bottom
R22  2.43,6.18 90 bottom
R24  2.54,30.06 0 bottom
R25  2.28,25.42 180 bottom
R38  7,32.99 0 top
R39  15.33,34.1 180 top
R41  11.35,35.63 90 top
R43  4.07,37.59 0 top
RSENSE  13.82,34.45 90 bottom
U1  18.25,34.87 180 bottom
U2  10.37,30.67 180 top
U3  5.42,6.02 180 bottom
U4  8.01,15.1 0 bottom
U5  6.58,26.18 90 bottom
U8  5.25,14.11 270 top
X2  14.46,10.5 90 bottom

### Tracks (layer width: path | path; a pad name or v marks a point on that pad's centre or on a via)
!RESET  (2 unrouted)
AREF  (1 unrouted)
BUZZER  (1 unrouted)
COMP_TPS  (2 unrouted)
DAC  (1 unrouted)
EN_TPS  (1 unrouted)
EN_VCC_2  (2 unrouted)
FB  (4 unrouted)
FREQ_TPS  (1 unrouted)
GND  (26 unrouted)
  pour Bottom (isolate 0.254): 0.33,46.65 24.88,46.65 25.28,46.25 25.28,-0.49 0.33,-0.49
  pour GND (isolate 0.254): 0.07,46.63 24.41,46.63 25.28,45.76 25.28,-0.61 0.07,-0.61
IN+  (via drill 1.5 pad 2.5)
  other vias: 22.87,26.58
IOSENSE  (3 unrouted)
LDO_EN  (3 unrouted)
N$1  (2 unrouted)
N$2  (1 unrouted)
N$3  (1 unrouted)
N$5  (3 unrouted)
N$6  (2 unrouted)
N$8  (2 unrouted)
N$9  (2 unrouted)
N$10  (2 unrouted)
N$11  (1 unrouted)
N$12  (2 unrouted)
N$13  (1 unrouted)
N$17  (1 unrouted)
N$19  (1 unrouted)
N$22  (1 unrouted)
N$35  (1 unrouted)
N$43  (1 unrouted)
OP_SWITCH  (2 unrouted)
SW2_TPS  (4 unrouted)
SWCLK  (3 unrouted)
SWDIO  (3 unrouted)
TXO  (1 unrouted)
VBUS  (11 unrouted)
VCC  (16 unrouted)
  pour Route2 (isolate 0.254, rank 2): -0.17,46.77 25.43,46.77 25.43,-0.64 -0.17,-0.64
VCC_2  (3 unrouted)
VDDCORE1  (1 unrouted)
VINSENSE  (3 unrouted)
VOUT+  (10 unrouted)
VOUT-  (3 unrouted)
VOUTSENSE  (4 unrouted)
VSOURCE  (9 unrouted)
(copper drawn outside any net)
  shapes: Top area x2

### Text on the board
tNames: SDA | SCL
bNames: BATT_GRIP / rover R-1 / v1-Nov'25